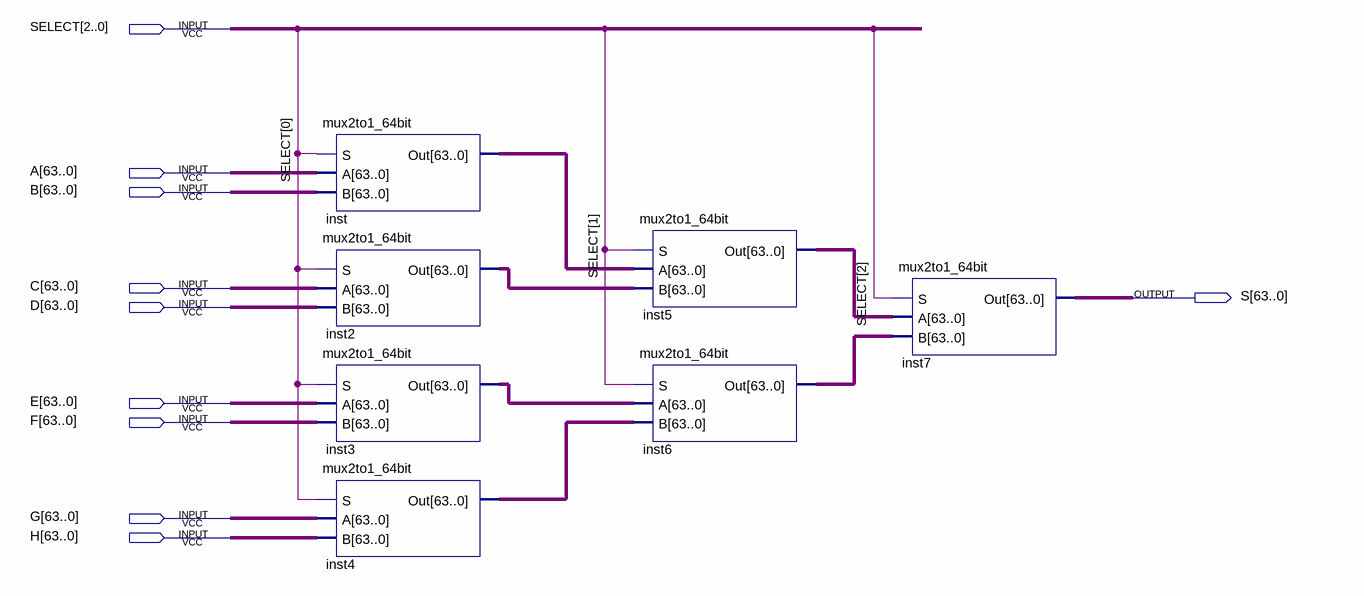
[diagram p0: schematic sheet]
// Quartus schematic MUX_8TO1_64BIT.bdf as structural Verilog: 7 symbols, 10 pins
module MUX_8TO1_64BIT (
  input  [2:0] SELECT,
  input  [63:0] A,
  input  [63:0] B,
  input  [63:0] C,
  input  [63:0] D,
  input  [63:0] E,
  input  [63:0] F,
  input  [63:0] G,
  input  [63:0] H,
  output [63:0] S
);

  wire [63:0] inst2_out, inst3_out, inst4_out, inst5_out, inst6_out, inst_out;

  mux2to1_64bit inst (.S(SELECT[0]), .A(A), .B(B), .Out(inst_out));
  mux2to1_64bit inst2 (.S(SELECT[0]), .A(C), .B(D), .Out(inst2_out));
  mux2to1_64bit inst3 (.S(SELECT[0]), .A(E), .B(F), .Out(inst3_out));
  mux2to1_64bit inst4 (.S(SELECT[0]), .A(G), .B(H), .Out(inst4_out));
  mux2to1_64bit inst5 (.S(SELECT[1]), .A(inst_out), .B(inst2_out), .Out(inst5_out));
  mux2to1_64bit inst6 (.S(SELECT[1]), .A(inst3_out), .B(inst4_out), .Out(inst6_out));
  mux2to1_64bit inst7 (.S(SELECT[2]), .A(inst5_out), .B(inst6_out), .Out(S));
endmodule
